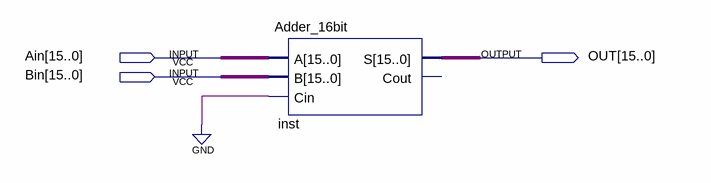
[diagram p0: schematic sheet]
// Quartus schematic ADD_16bit.bdf as structural Verilog: 1 symbols, 3 pins
module ADD_16bit (
  input  [15:0] Ain,
  input  [15:0] Bin,
  output [15:0] OUT
);

  Adder_16bit inst (.A(Ain), .B(Bin), .Cin(1'b0), .S(OUT));  // open: Cout
endmodule
